# EAGLE schematic Prototype3 (EAGLE 7.1.0)
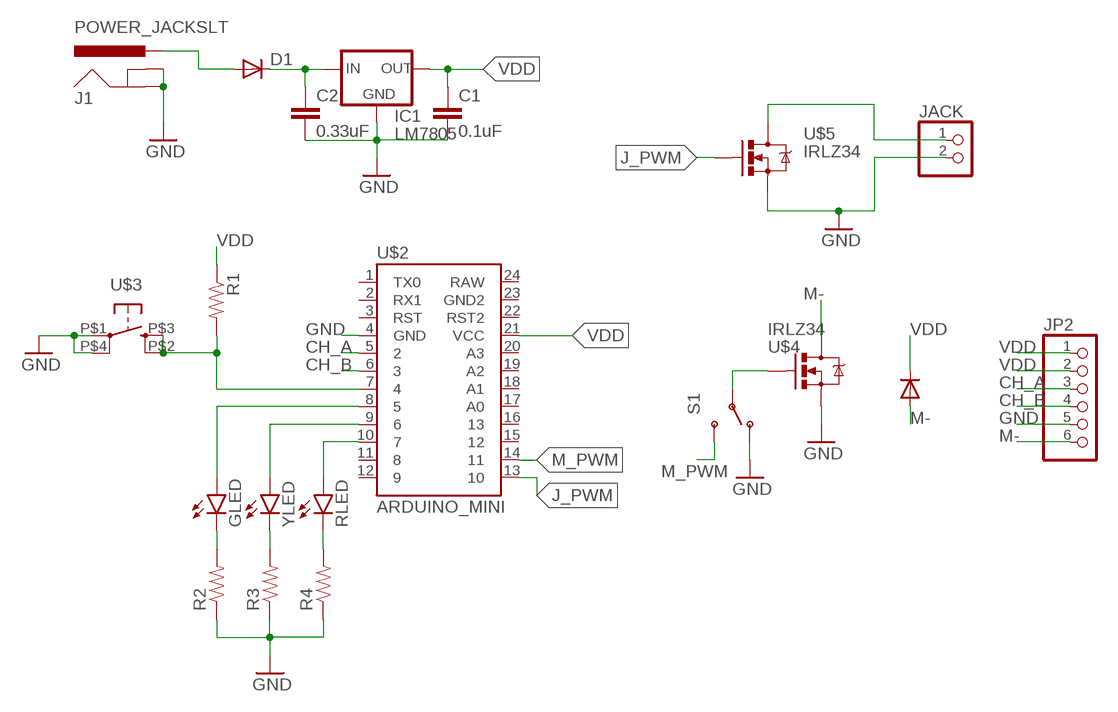
[diagram p0: schematic, sheet 1]

## Parts
C1  0.1uF  C5/2.5  [C5B2.5]
C2  0.33uF  C5/2.5  [C5B2.5]
D1  SCHOTTKY-DIODE  [SMD-DIODE]
GLED  LED3MM  [LED3MM]
IC1  LM7805  [TO-220(2)]
J1  POWER_JACKSLT  [POWER_JACK_SLOT]
JACK  PINHD-1X2  [1X02]
JP2  PINHD-1X6  [1X06]
R1  RESISTORAXIAL-0.3  [AXIAL-0.3]
R2  RESISTORAXIAL-0.3  [AXIAL-0.3]
R3  RESISTORAXIAL-0.3  [AXIAL-0.3]
R4  RESISTORAXIAL-0.3  [AXIAL-0.3]
RLED  LED3MM  [LED3MM]
S1  SWITCH-SPDTKIT  [SWITCH-SPDT_KIT]
U$1  SCHOTTKY-DIODE  [SMD-DIODE]
U$2  ARDUINO_MINI  [ARDUINO_MINI]
U$3  PUSH-BUTTON  [PUSHBTTN]
U$4  IRLZ34  [TO-220(2)]
U$5  IRLZ34  [TO-220(2)]
YLED  LED3MM  [LED3MM]

## Nets
CH_A: JP2.3 U$2.5
CH_B: JP2.4 U$2.6
GND [Power]: C1.2 C2.2 IC1.GND J1.GND@1(GNDBREAK) J1.GND@2(GND) JACK.2 JP2.5 R2.P$1 R3.P$1 R4.P$1 S1.1(O) U$2.4(GND) U$3.P$1 U$3.P$4 U$4.OUT(S) U$5.OUT(S)
J_PWM: U$2.13 U$5.IN(G)
M- [Power]: JP2.6 U$1.P$1(A) U$4.GND(D)
M_PWM: S1.3(S) U$2.14
N$1: JACK.1 U$5.GND(D)
N$2: D1.P$1(A) J1.PWR
N$3: S1.2(P) U$4.IN(G)
N$5 [Power]: C2.1 D1.P$2(C) IC1.IN
N$12: R4.P$2 RLED.K(C)
N$13: R3.P$2 YLED.K(C)
N$14: GLED.K(C) R2.P$2
N$15: GLED.A U$2.8
N$16: U$2.9 YLED.A
N$17: RLED.A U$2.10
N$18: R1.P$2 U$2.7 U$3.P$2 U$3.P$3
VDD [Power]: C1.1 IC1.OUT JP2.1 JP2.2 R1.P$1 U$1.P$2(C) U$2.21(VCC)
Unconnected: U$2.1(TX0) U$2.2(RX1) U$2.3(RST) U$2.11 U$2.12 U$2.15 U$2.16 U$2.17(A0) U$2.18(A1) U$2.19(A2) U$2.20(A3) U$2.22(RST2) U$2.23(GND2) U$2.24(RAW)

## Library data of the parts
C1 C2 = capacitor-wima:C: CAPACITOR naming: grid - package width
D1 U$1 = gripper-lib:SCHOTTKY-DIODE
GLED RLED YLED = SparkFun-LED:LED: LEDs Standard schematic elements and footprints for 5mm, 3mm, 1206, and 0603 sized LEDs. 5mm - Spark Fun Electronics SKU : COM-00529 (and others)
IC1 = gripper-lib:LM7805
J1 = SparkFun:POWER_JACK: Power Jack This is the standard 5.5mm barrel jack for power. The PTH is the most common, proven, reliable, footprint. All others are experimental. The Slot footprint only works if the mill layer is transmitted to the PCB fab house so be warned. Spark Fun Electronics SKU : PRT-00119. Mating wall wart : TOL-00298 (and others)
JACK = pinhead:PINHD-1X2: PIN HEADER
JP2 = pinhead:PINHD-1X6: PIN HEADER
R1-R4 = SparkFun:RESISTOR: Resistor Basic schematic elements and footprints for 0603, 1206, and PTH resistors.
S1 = SparkFun-Electromechanical:SWITCH-SPDT: SPDT Switch Simple slide switch, Spark Fun Electronics SKU : COM-00102 DPDT SMT slide switch, AYZ0202, SWCH-08179; PROD_ID: SWCH-08261
U$2 = SparkFun:ARDUINO_MINI
U$3 = gripper-lib:PUSH-BUTTON
U$4 U$5 = gripper-lib:IRLZ34

## Net classes
0 default: width 0.254 mm
1 Power: width 1.27 mm